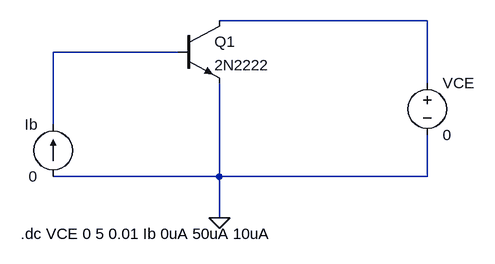
[diagram p0: schematic Draft2.asc]
Draft2.asc, the LTspice schematic file:
Version 4
SHEET 1 880 680
WIRE 528 32 208 32
WIRE 144 80 -48 80
WIRE 528 128 528 32
WIRE -48 192 -48 80
WIRE 208 272 208 128
WIRE 208 272 -48 272
WIRE 528 272 528 208
WIRE 528 272 208 272
WIRE 208 336 208 272
FLAG 208 336 0
SYMBOL npn 144 32 R0
SYMATTR InstName Q1
SYMATTR Value 2N2222
SYMBOL current -48 272 R180
WINDOW 0 24 80 Left 2
WINDOW 3 24 0 Left 2
WINDOW 123 0 0 Left 0
WINDOW 39 0 0 Left 0
SYMATTR InstName Ib
SYMATTR Value 0
SYMBOL voltage 528 112 R0
WINDOW 123 0 0 Left 0
WINDOW 39 0 0 Left 0
SYMATTR InstName VCE
SYMATTR Value 0
TEXT -98 360 Left 2 !.dc VCE 0 5 0.01 Ib 0uA 50uA 10uA

The netlist it stands for:
* Draft2.asc
Q1 N001 N002 0 0 2N2222
Ib 0 N002 0
VCE N001 0 0
.model NPN NPN
.model PNP PNP
.lib standard.bjt
.dc VCE 0 5 0.01 Ib 0uA 50uA 10uA
.backanno
.end